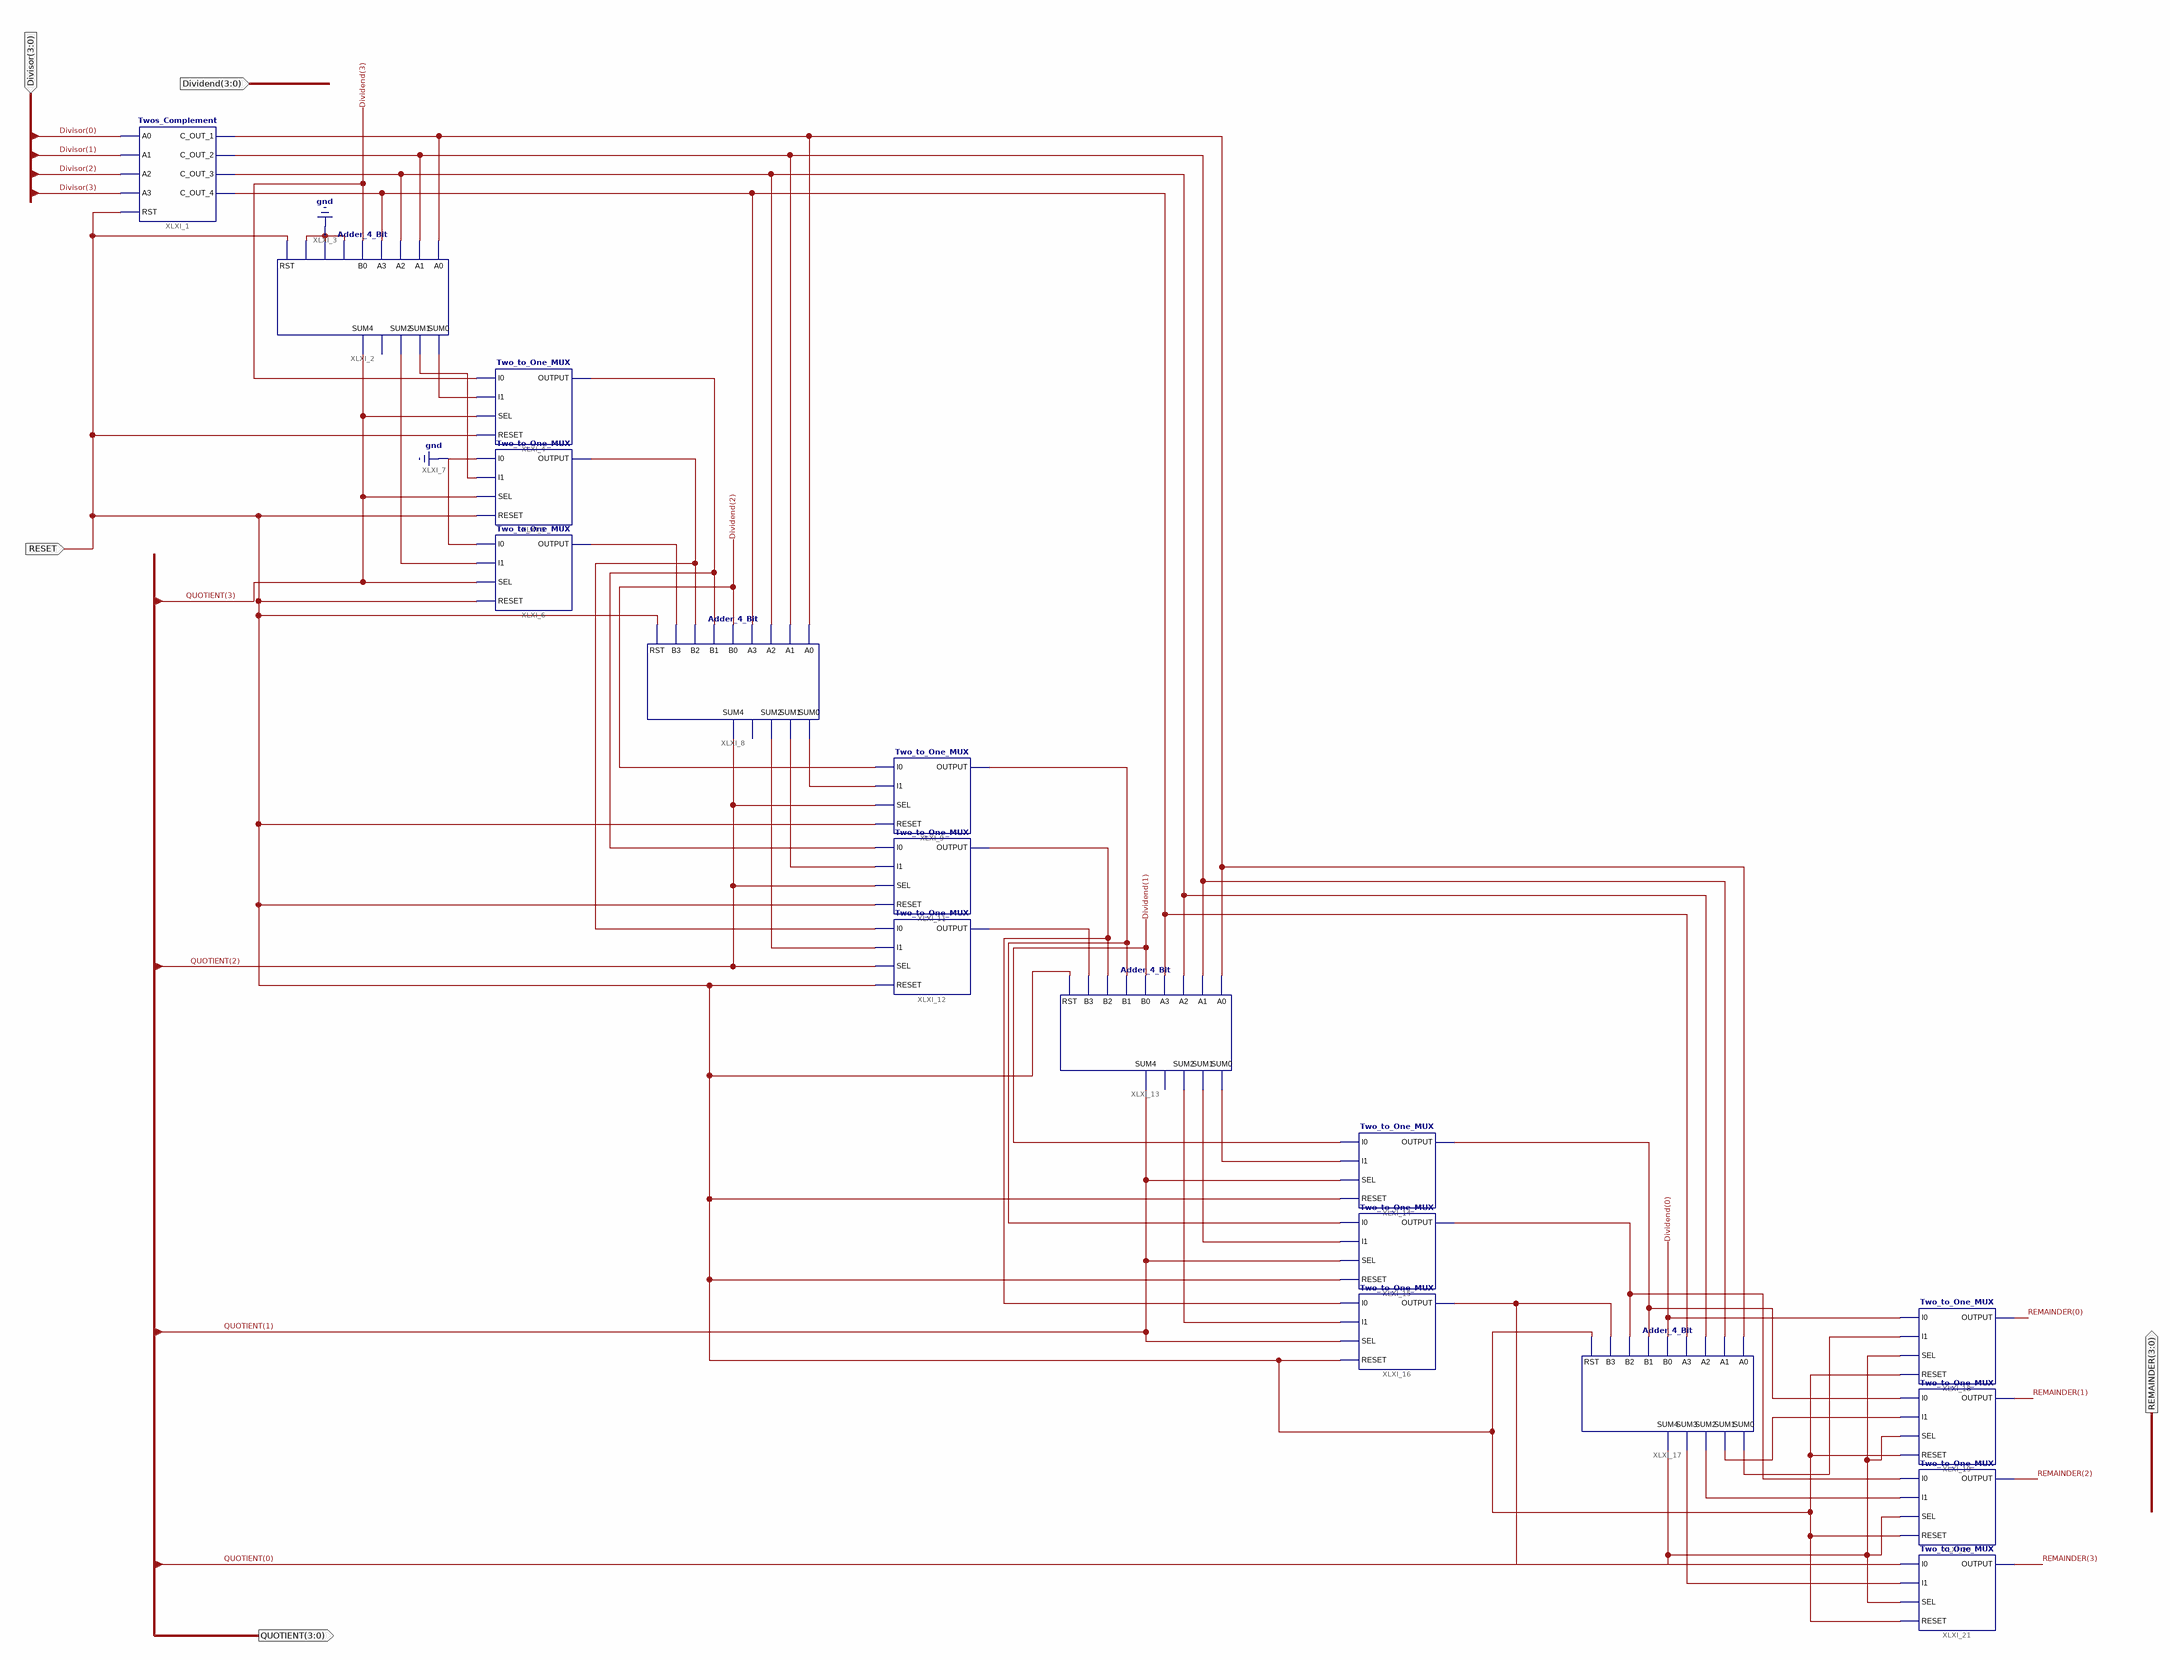
[diagram p0: schematic sheet 1]
// Xilinx ISE schematic Four_Bit_Divider.sch (spartan6) as structural Verilog: 18 symbols, 5 ports
module Four_Bit_Divider (
  input  [3:0] Divisor,
  input  [3:0] Dividend,
  input  RESET,
  output [3:0] REMAINDER,
  output [3:0] QUOTIENT
);

  wire XLXN_28, XLXN_29, XLXN_31, XLXN_42, XLXN_44, XLXN_45, XLXN_46, XLXN_48, XLXN_49, XLXN_58, XLXN_60,
       XLXN_61, XLXN_62, XLXN_63, XLXN_64, XLXN_73, XLXN_74, XLXN_75, XLXN_76, XLXN_78, XLXN_79, XLXN_81,
       XLXN_82, XLXN_83, XLXN_95, XLXN_96;

  Twos_Complement XLXI_1 (
    .A0(Divisor[0]), .A1(Divisor[1]), .A2(Divisor[2]), .A3(Divisor[3]), .C_OUT_1(XLXN_73), .C_OUT_2(XLXN_74),
    .C_OUT_3(XLXN_75), .C_OUT_4(XLXN_76), .RST(RESET));
  Adder_4_Bit XLXI_2 (
    .A0(XLXN_73), .A1(XLXN_74), .A2(XLXN_75), .A3(XLXN_76), .B0(Dividend[3]), .B1(1'b0), .B2(1'b0),
    .B3(1'b0), .RST(RESET), .SUM0(XLXN_28), .SUM1(XLXN_29), .SUM2(XLXN_31), .SUM4(QUOTIENT[3]));  // open: SUM3
  Two_to_One_MUX XLXI_4 (.I0(Dividend[3]), .I1(XLXN_28), .OUTPUT(XLXN_44), .RESET(RESET), .SEL(QUOTIENT[3]));
  Two_to_One_MUX XLXI_5 (.I0(1'b0), .I1(XLXN_29), .OUTPUT(XLXN_45), .RESET(RESET), .SEL(QUOTIENT[3]));
  Two_to_One_MUX XLXI_6 (.I0(1'b0), .I1(XLXN_31), .OUTPUT(XLXN_42), .RESET(RESET), .SEL(QUOTIENT[3]));
  Adder_4_Bit XLXI_8 (
    .A0(XLXN_73), .A1(XLXN_74), .A2(XLXN_75), .A3(XLXN_76), .B0(Dividend[2]), .B1(XLXN_44), .B2(XLXN_45),
    .B3(XLXN_42), .RST(RESET), .SUM0(XLXN_46), .SUM1(XLXN_48), .SUM2(XLXN_49), .SUM4(QUOTIENT[2]));  // open: SUM3
  Two_to_One_MUX XLXI_9 (.I0(Dividend[2]), .I1(XLXN_46), .OUTPUT(XLXN_60), .RESET(RESET), .SEL(QUOTIENT[2]));
  Two_to_One_MUX XLXI_11 (.I0(XLXN_44), .I1(XLXN_48), .OUTPUT(XLXN_61), .RESET(RESET), .SEL(QUOTIENT[2]));
  Two_to_One_MUX XLXI_12 (.I0(XLXN_45), .I1(XLXN_49), .OUTPUT(XLXN_58), .RESET(RESET), .SEL(QUOTIENT[2]));
  Adder_4_Bit XLXI_13 (
    .A0(XLXN_73), .A1(XLXN_74), .A2(XLXN_75), .A3(XLXN_76), .B0(Dividend[1]), .B1(XLXN_60), .B2(XLXN_61),
    .B3(XLXN_58), .RST(RESET), .SUM0(XLXN_62), .SUM1(XLXN_63), .SUM2(XLXN_64), .SUM4(QUOTIENT[1]));  // open: SUM3
  Two_to_One_MUX XLXI_14 (.I0(Dividend[1]), .I1(XLXN_62), .OUTPUT(XLXN_78), .RESET(RESET), .SEL(QUOTIENT[1]));
  Two_to_One_MUX XLXI_15 (.I0(XLXN_60), .I1(XLXN_63), .OUTPUT(XLXN_79), .RESET(RESET), .SEL(QUOTIENT[1]));
  Two_to_One_MUX XLXI_16 (.I0(XLXN_61), .I1(XLXN_64), .OUTPUT(XLXN_95), .RESET(RESET), .SEL(QUOTIENT[1]));
  Adder_4_Bit XLXI_17 (
    .A0(XLXN_73), .A1(XLXN_74), .A2(XLXN_75), .A3(XLXN_76), .B0(Dividend[0]), .B1(XLXN_78), .B2(XLXN_79),
    .B3(XLXN_95), .RST(RESET), .SUM0(XLXN_81), .SUM1(XLXN_82), .SUM2(XLXN_83), .SUM3(XLXN_96),
    .SUM4(QUOTIENT[0]));
  Two_to_One_MUX XLXI_18 (.I0(Dividend[0]), .I1(XLXN_81), .OUTPUT(REMAINDER[0]), .RESET(RESET), .SEL(QUOTIENT[0]));
  Two_to_One_MUX XLXI_19 (.I0(XLXN_78), .I1(XLXN_82), .OUTPUT(REMAINDER[1]), .RESET(RESET), .SEL(QUOTIENT[0]));
  Two_to_One_MUX XLXI_20 (.I0(XLXN_79), .I1(XLXN_83), .OUTPUT(REMAINDER[2]), .RESET(RESET), .SEL(QUOTIENT[0]));
  Two_to_One_MUX XLXI_21 (.I0(XLXN_95), .I1(XLXN_96), .OUTPUT(REMAINDER[3]), .RESET(RESET), .SEL(QUOTIENT[0]));
endmodule
